# EAGLE design Amplifier_ABE_minEv (EAGLE 9.2.2)
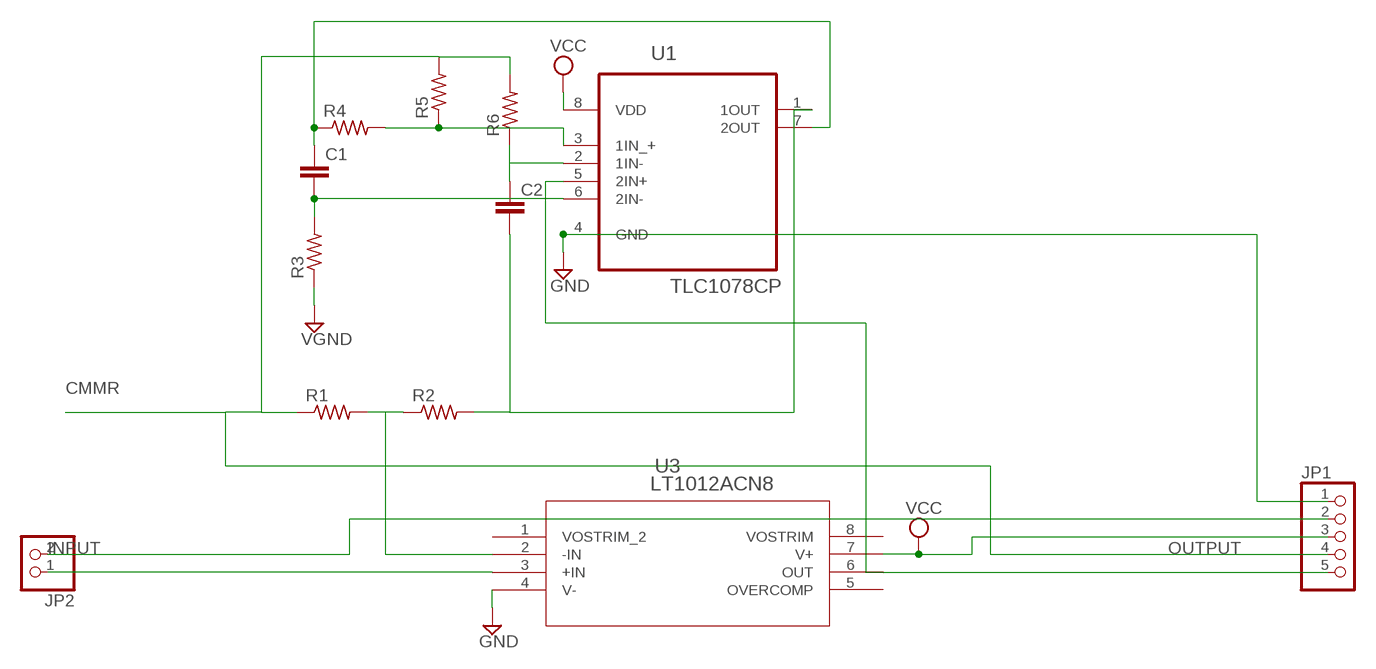
[diagram p0: schematic, sheet 1]

## Parts
C1  C-EU025-024X044  [C025-024X044]
C2  C-EU025-024X044  [C025-024X044]
JP1  PINHD-1X5  [1X05]
JP2  PINHD-1X2  [1X02]
R1  R-US_0204/7  [0204/7]
R2  R-US_0204/7  [0204/7]
R3  R-US_0204/5  [0204/5]
R4  R-US_0204/7  [0204/7]
R5  R-US_0204/7  [0204/7]
R6  R-US_0204/5  [0204/5]
U1  TLC1078CP  [DIP254P762X508-8]
U3  LT1012ACN8  [LT1012ACN8_PDIP-8_N]

## Nets
CMMR: JP1.4 R1.1 R5.2 R6.2
GND: JP1.1 R3.1 U1.4(GND) U3.4(V-) ; supply symbol labelled VGND
INPUT: JP2.1 U3.3(+IN)
N$1: R1.2 R2.1 U3.2(-IN)
N$2: JP1.2 JP2.2
N$4: C2.2 R2.2 U1.1(1OUT)
N$5: C1.2 R3.2 U1.6(2IN-)
N$6: C1.1 R4.1 U1.7(2OUT)
N$7: R4.2 R5.1 U1.3(1IN_+)
N$9: C2.1 R6.1 U1.2(1IN-)
OUTPUT: JP1.5 U1.5(2IN+) U3.6(OUT)
VCC: JP1.3 U1.8(VDD) U3.7(V+)
Unconnected: U3.1(VOSTRIM_2) U3.5(OVERCOMP) U3.8(VOSTRIM)

## Library data of the parts
C1 C2 = resistor:C-EU: CAPACITOR, European symbol
JP1 = pinhead:PINHD-1X5: PIN HEADER
JP2 = pinhead:PINHD-1X2: PIN HEADER
R1-R6 = rcl:R-US_: RESISTOR, American symbol; SPICEPREFIX: R
U1 = SnapEDA-Library:TLC1078CP: OPERATIONAL AMPLIFIER; MPN: TLC1078CP; OC_FARNELL: -; OC_NEWARK: 90B1029; PACKAGE: PDIP; SUPPLIER: Texas Instruments
U3 = SnapEDA-Library:LT1012ACN8; COPYRIGHT: Copyright C 2016 Accelerated Designs. All rights reserved; DIGIKEY_PART_NUMBER: LT1012ACN8ND; MANUFACTURER_PART_NUMBER: LT1012ACN8; VENDOR: Linear Technology

## Board
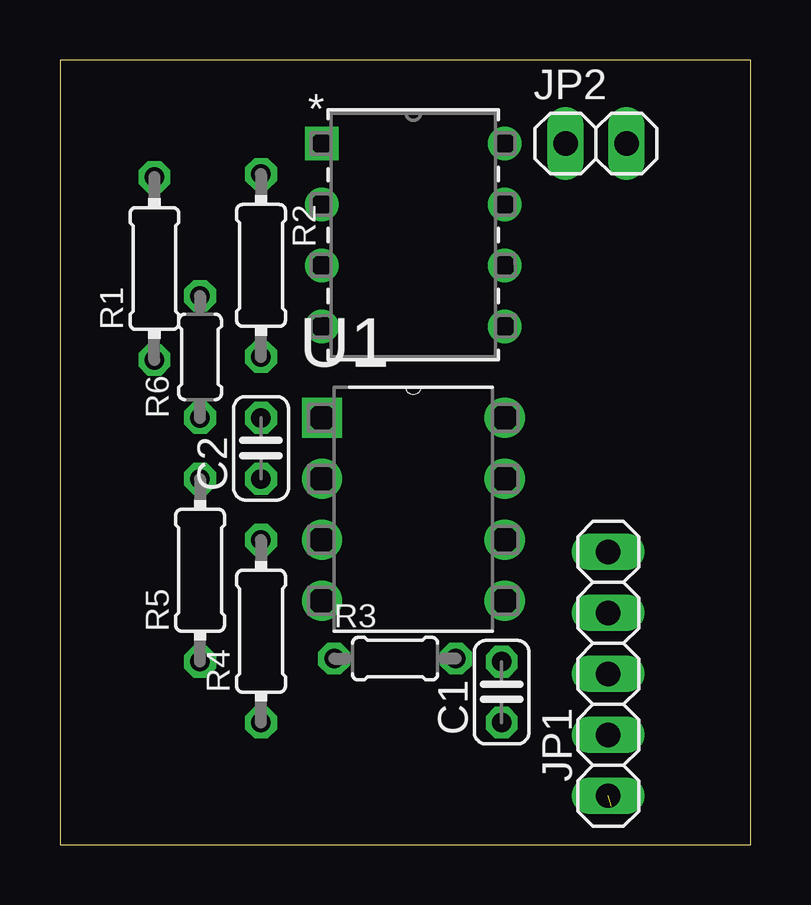
[diagram p1: board, top side]
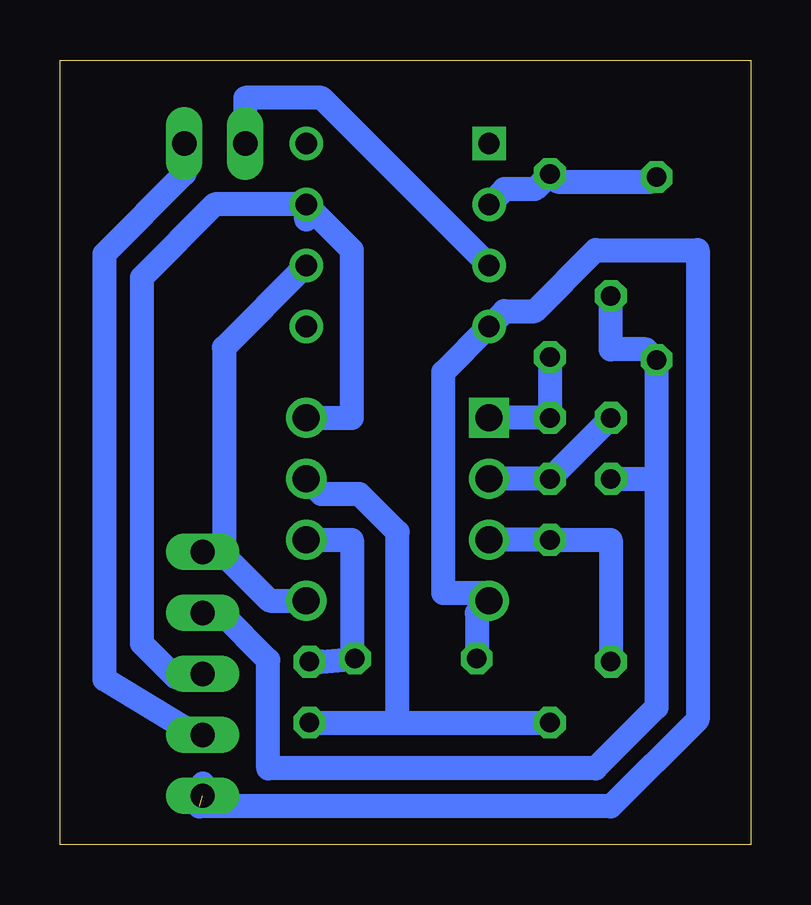
[diagram p2: board, bottom side, seen from below]

Size 28.81 x 32.69 mm. Coordinates in mm from the lower left corner, seen from the top.
Outline: 0,0 28.81,0 28.81,32.69 0,32.69 0,0
Copper layers (1*16): Top 0.035mm / dielectric 1.5mm / Bottom 0.035mm
Design rules "default *": minimum track width 1mm, minimum drill 0.35mm, track to track 0.5mm, track to pad 0.5mm, pad to pad 0.5mm, via to via 0.5mm, smd to smd 6mil, copper to edge 40mil, drill to drill 6mil, minimum pad ring 10mil, minimum via ring 8mil, stop-mask expansion 4mil, vias tented up to drill 0mil, thermal gap 10mil

### Footprints (pad centres in the part's own frame; a part is rotated, then mirrored left to right if it is on the bottom)
C025-024X044 = drill 0.813 octagon: 1 -1.27,0; 2 1.27,0
1X05 = drill 1.016 long: 1 -5.08,0; 2 -2.54,0; 3 0,0; 4 2.54,0; 5 5.08,0
1X02 = drill 1.016 long: 1 -1.27,0; 2 1.27,0
0204/7 = drill 0.813 octagon: 1 -3.81,0; 2 3.81,0
0204/5 = drill 0.813 octagon: 1 -2.54,0; 2 2.54,0
DIP254P762X508-8 = drill 1.118 square: 1 -7.62,7.62 | drill 1.118: 2 -7.62,5.08; 3 -7.62,2.54; 4 -7.62,0; 5 0,0; 6 0,2.54; 7 0,5.08; 8 0,7.62
LT1012ACN8_PDIP-8_N = drill 0.889 pad 1.397 square: 1 -7.62,7.62 | drill 0.889 pad 1.397: 2 -7.62,5.08; 3 -7.62,2.54; 4 -7.62,0; 5 0,0; 6 0,2.54; 7 0,5.08; 8 0,7.62

### Placement (x,y rotation side)
C1  18.41,6.35 90 top
C2  8.38,16.51 90 top
JP1  22.86,7.11 90 top
JP2  22.35,29.21 0 top
R1  3.94,24 90 top
R2  8.38,24.13 270 top
R3  13.97,7.75 0 top
R4  8.38,8.89 90 top
R5  5.84,11.43 90 top
R6  5.84,20.32 90 top
U1  18.54,10.16 0 top
U3  18.54,21.59 0 top

### Tracks (layer width: path | path; a pad name or v marks a point on that pad's centre or on a via)
CMMR
  Bottom 1: 3.94,15.24 R1.1 4.38,20.64 5.84,20.64 R6.2 | R5.2 3.94,15.24 | 3.94,15.24 3.94,5.71 6.48,3.17 20.13,3.17 20.13,7.68 22.1,9.65 JP1.4
GND  (1 unrouted)
  Bottom 1: R3.1 11.43,9.65 U1.4 11.24,10.48 12.83,10.48 12.83,19.68 U3.4 10.29,22.23 9.02,22.23 6.48,24.77 2.22,24.77 2.22,5.21 5.84,1.59 22.99,1.59 | JP1.1 22.86,2.54
INPUT
  Bottom 1: JP2.1 21.08,31.11 17.91,31.11 U3.3
N$1
  Bottom 1: R1.2 4.13,27.62 8.06,27.62 R2.1 9.02,27.3 10.29,27.3 U3.2
N$2
  Bottom 1: 22.73,4.32 26.96,6.88 26.96,24.61 23.62,27.94 JP2.2
N$4
  Bottom 1: R2.2 C2.2 U1.1
N$5
  Bottom 1: C1.2 17.91,7.62 R3.2 16.64,7.76 16.64,12.7 U1.6
N$6
  Bottom 1: C1.1 14.73,5.08 | 14.73,5.08 R4.1 | U1.7 17.91,14.61 16.32,14.61 14.73,13.02 14.73,5.08
N$7
  Bottom 1: R5.1 5.84,12.7 R4.2 U1.3
N$9
  Bottom 1: R6.1 C2.1 U1.2
OUTPUT
  Bottom 1: U3.6 21.97,20.7 21.97,12.06 | 21.97,12.06 20.07,10.16 U1.5 | JP1.5 22.73,12.06 21.97,12.06
VCC
  Bottom 1: U3.7 16.64,24.77 16.64,17.78 U1.8 | 18.54,26.04 U3.7 | U3.7 22.35,26.67 25.4,23.62 25.4,8.38 24,6.99 23.88,7.11 JP1.3